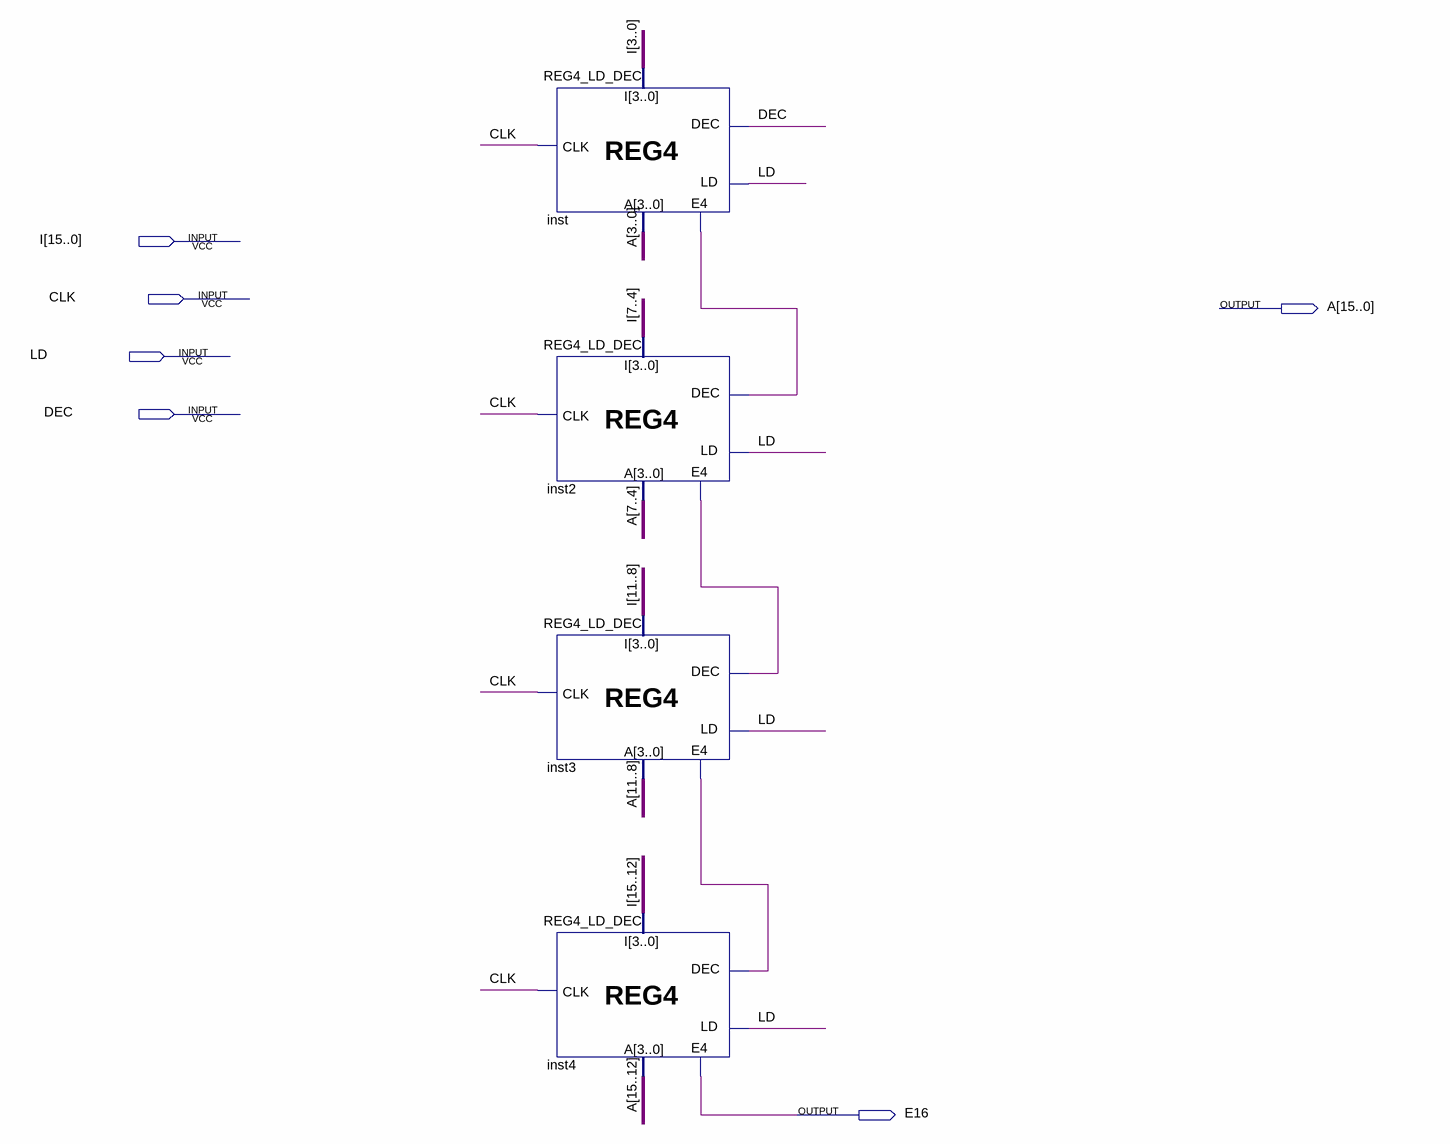
[diagram p0: schematic sheet]
// Quartus schematic REG16_LD_DEC.bdf as structural Verilog: 4 symbols, 6 pins
module REG16_LD_DEC (
  input  [15:0] I,
  input  CLK,
  input  LD,
  input  DEC,
  output [15:0] A,
  output E16
);

  wire inst2_e4, inst3_e4, inst_e4;

  REG4_LD_DEC inst (.LD(LD), .DEC(DEC), .CLK(CLK), .I(I[3:0]), .A(A[3:0]), .E4(inst_e4));
  REG4_LD_DEC inst2 (.LD(LD), .DEC(inst_e4), .CLK(CLK), .I(I[7:4]), .A(A[7:4]), .E4(inst2_e4));
  REG4_LD_DEC inst3 (.LD(LD), .DEC(inst2_e4), .CLK(CLK), .I(I[11:8]), .A(A[11:8]), .E4(inst3_e4));
  REG4_LD_DEC inst4 (.LD(LD), .DEC(inst3_e4), .CLK(CLK), .I(I[15:12]), .A(A[15:12]), .E4(E16));
endmodule
